# EAGLE design SparkFun_openScale (EAGLE 7.5.0)
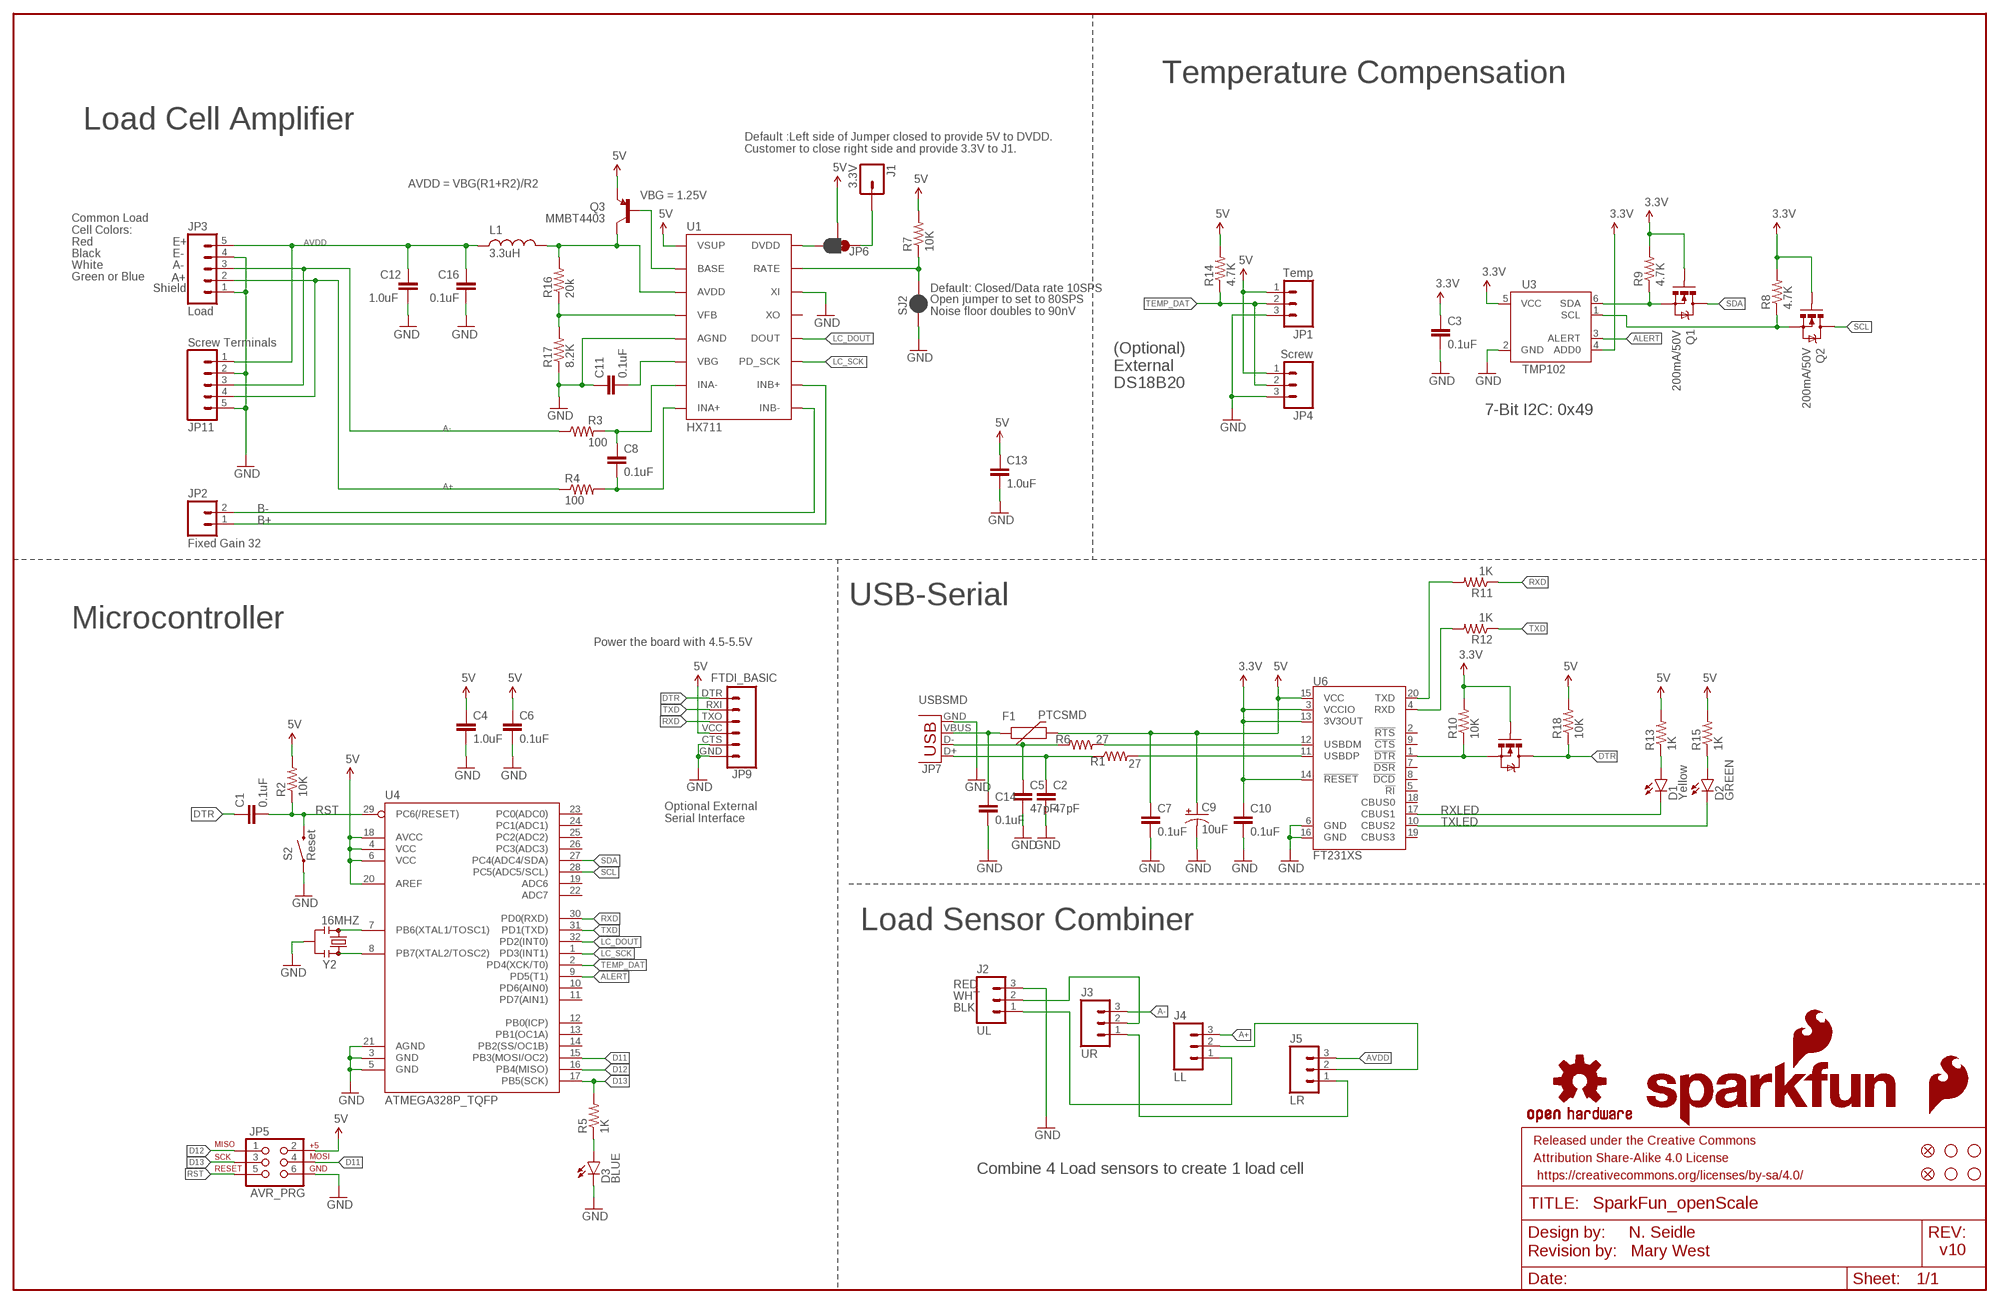
[diagram p0: schematic, sheet 1]

## Parts
C1  0.1uF  0.1UF-25V(+80/-20%)(0603)  [0603-CAP]
C2  47pF  47PF-50V-5%(0603)  [0603-CAP]
C3  0.1uF  0.1UF-25V(+80/-20%)(0603)  [0603-CAP]
C4  1.0uF  1.0UF-16V-10%(0603)  [0603-CAP]
C5  47pF  47PF-50V-5%(0603)  [0603-CAP]
C6  0.1uF  0.1UF-25V(+80/-20%)(0603)  [0603-CAP]
C7  0.1uF  0.1UF-25V(+80/-20%)(0603)  [0603-CAP]
C8  0.1uF  0.1UF-25V(+80/-20%)(0603)  [0603-CAP]
C9  10uF  10UF-16V-10%(TANT)  [EIA3216]
C10  0.1uF  0.1UF-25V(+80/-20%)(0603)  [0603-CAP]
C11  0.1uF  0.1UF-25V(+80/-20%)(0603)  [0603-CAP]
C12  1.0uF  1.0UF-16V-10%(0603)  [0603-CAP]
C13  1.0uF  1.0UF-16V-10%(0603)  [0603-CAP]
C14  0.1uF  0.1UF-25V(+80/-20%)(0603)  [0603-CAP]
C16  0.1uF  0.1UF-25V(+80/-20%)(0603)  [0603-CAP]
D1  Yellow  LED-YELLOWLILYPAD  [LED-1206]
D2  GREEN  LED-GREEN1206  [LED-1206]
D3  BLUE  LED-BLUE1206  [LED-1206]
F1  PTCSMD  [PTC-1206]
FID1  FIDUCIALUFIDUCIAL  [MICRO-FIDUCIAL]
FID2  FIDUCIALUFIDUCIAL  [MICRO-FIDUCIAL]
FRAME1  FRAME-LEDGER  [CREATIVE_COMMONS]
J1  3.3V  M01PTH  [1X01]
J2  UL  M03PTH  [1X03]
J3  UR  M03PTH  [1X03]
J4  LL  M03PTH  [1X03]
J5  LR  M03PTH  [1X03]
JP1  Temp  M031X03_NO_SILK  [1X03_NO_SILK]
JP2  Fixed Gain 32  M02PTH  [1X02]
JP3  Load  M05NO_SILK  [1X05_NO_SILK]
JP4  Screw  M03SCREW_LOCK  [SCREWTERMINAL-3.5MM-3_LOCK.007S]
JP5  AVR_PRG  AVR_SPI_PRG_6PTH  [2X3]
JP6  JUMPER-PAD-3-2OF3_NC_BY_PASTE  [PAD-JUMPER-3-2OF3_NC_BY_PASTE_YES_SILK_FULL_BOX]
JP7  USBSMD  [USB-MINIB]
JP9  FTDI_BASIC  FTDI_BASICPTH  [FTDI_BASIC]
JP11  Screw Terminals  M05SCREW  [SCREWTERMINAL-3.5MM-5]
L1  3.3uH  INDUCTOR0805-IND  [0805]
LOGO2  OSHW-LOGOS  [OSHW-LOGO-S]
LOGO3  SFE_LOGO_FLAME.1_INCH  [SFE_LOGO_FLAME_.1]
LOGO4  SFE_LOGO_NAME_FLAME.1_INCH  [SFE_LOGO_NAME_FLAME_.1]
Q1  200mA/50V  MOSFET-NCHANNELBSS138  [SOT23-3]
Q2  200mA/50V  MOSFET-NCHANNELBSS138  [SOT23-3]
Q3  MMBT4403  TRANSISTOR_PNPMMBT4403  [SOT23-3]
Q4  MOSFET-NCHANNEL2N7002PW  [SOT323]
R1  27  27OHM1/10W1%(0603)  [0603]
R2  10K  10KOHM-1/10W-1%(0603)0603  [0603-RES]
R3  100  100OHM-1/10W-1%(0603)  [0603-RES]
R4  100  100OHM-1/10W-1%(0603)  [0603-RES]
R5  1K  1KOHM-1/10W-1%(0603)  [0603-RES]
R6  27  27OHM1/10W1%(0603)  [0603]
R7  10K  10KOHM-1/10W-1%(0603)0603  [0603-RES]
R8  4.7K  4.7KOHM-1/10W-1%(0603)  [0603-RES]
R9  4.7K  4.7KOHM-1/10W-1%(0603)  [0603-RES]
R10  10K  10KOHM-1/10W-1%(0603)0603  [0603-RES]
R11  1K  1KOHM-1/10W-1%(0603)  [0603-RES]
R12  1K  1KOHM-1/10W-1%(0603)  [0603-RES]
R13  1K  1KOHM-1/10W-1%(0603)  [0603-RES]
R14  4.7K  4.7KOHM-1/10W-1%(0603)  [0603-RES]
R15  1K  1KOHM-1/10W-1%(0603)  [0603-RES]
R16  20k  20KOHM1/10W1%(0603)  [0603-RES]
R17  8.2K  8.2KOHM-1/10W-5%(0603)  [0603-RES]
R18  10K  10KOHM-1/10W-1%(0603)0603  [0603-RES]
S2  Reset  SWITCH-MOMENTARY-2SMD  [TACTILE-SWITCH-SMD]
SJ2  JUMPER-PAD-2-NC_BY_PASTE  [PAD-JUMPER-2-NC_BY_PASTE_YES_SILK]
STANDOFF1  STAND-OFF  [STAND-OFF]
STANDOFF2  STAND-OFF  [STAND-OFF]
STANDOFF3  STAND-OFF  [STAND-OFF]
STANDOFF4  STAND-OFF  [STAND-OFF]
U1  HX711  HX711HX711  [SO16]
U3  TMP102  [SOT563]
U4  ATMEGA328P_TQFP  [TQFP32-08]
U6  FT231XS  [SSOP20_L]
Y2  16MHZ  RESONATOR16MHZ  [RESONATOR-SMD]

## Nets
2: J4.2 J5.2
3.3V [power]: C3.1 C10.1 Q1.1(G) Q2.1(G) Q4.1(G) R8.2 R9.2 R10.2 U3.4(ADD0) U3.5(VCC) U6.3(VCCIO) U6.13(3V3OUT) U6.14(!RESET)
5V: C4.1 C6.1 C7.1 C9.A(+) C13.1 F1.2 JP1.1 JP4.1 JP5.2 JP6.2 JP9.VCC Q3.2(E) R2.2 R7.2 R13.2 R14.2 R15.2 R18.2 U1.1(VSUP) U4.4(VCC) U4.6(VCC) U4.18(AVCC) U4.20(AREF) U6.15(VCC)
A+: J4.3 JP3.2 JP11.4 R4.1
A-: J3.3 JP3.3 JP11.3 R3.1
ALERT: U3.3(ALERT) U4.9(PD5(T1))
AVDD: C12.2 C16.1 J5.3 JP3.5 JP11.1 L1.1
B+: JP2.1 U1.10(INB+)
B-: JP2.2 U1.9(INB-)
D11: JP5.4 U4.15(PB3(MOSI/OC2))
D12: JP5.1 U4.16(PB4(MISO))
D13: JP5.3 R5.2 U4.17(PB5(SCK))
DTR: C1.1 JP9.DTR Q4.3(D) R18.1
GND [power]: C2.2 C3.2 C4.2 C5.2 C6.2 C7.2 C9.C(-) C10.2 C11.1 C12.1 C13.2 C14.2 C16.2 D3.C J2.3 JP1.3 JP3.1 JP3.4 JP4.3 JP5.6 JP7.GND JP9.CTS JP9.GND JP11.2 JP11.5 R17.1 S2.1 SJ2.1 U1.5(AGND) U1.14(XI) U3.2(GND) U4.3(GND) U4.5(GND) U4.21(AGND) U6.6(GND) U6.16(GND) Y2.2
LC_DOUT: U1.12(DOUT) U4.32(PD2(INT0))
LC_SCK: U1.11(PD_SCK) U4.1(PD3(INT1))
LV_SCL: Q2.2(S) R8.1 U3.1(SCL)
LV_SDA: Q1.2(S) R9.1 U3.6(SDA)
N$1: U4.7(PB6(XTAL1/TOSC1)) Y2.1
N$2: D3.A R5.1
N$3: U4.8(PB7(XTAL2/TOSC2)) Y2.3
N$4: C5.1 JP7.D- R6.1
N$5: D1.A R13.1
N$6: D2.A R15.1
N$7: C2.1 JP7.D+ R1.1
N$8: R6.2 U6.12(USBDM)
N$9: R7.1 SJ2.2 U1.15(RATE)
N$10: C8.1 R3.2 U1.7(INA-)
N$11: C8.2 R4.2 U1.8(INA+)
N$12: C14.1 F1.1 JP7.VBUS
N$13: R1.2 U6.11(USBDP)
N$14: R12.2 U6.4(RXD)
N$15: JP6.3 U1.16(DVDD)
N$16: R11.2 U6.20(TXD)
N$17: Q3.1(B) U1.2(BASE)
N$18: R16.1 R17.2 U1.4(VFB)
N$19: J1.1 JP6.1
N$20: J2.2 J3.2
N$21: C11.2 U1.6(VBG)
N$22: J2.1 J4.1
N$24: J3.1 J5.1
N$27: Q4.2(S) R10.1 U6.1(!DTR)
RIPUP@: L1.2 Q3.3(C) R16.2 U1.3(AVDD)
RST: C1.2 JP5.5 R2.1 S2.3 U4.29(PC6(/RESET))
RXD: JP9.TXO R11.1 U4.30(PD0(RXD))
RXLED: D1.C U6.17(CBUS1)
SCL: Q2.3(D) U4.28(PC5(ADC5/SCL))
SDA: Q1.3(D) U4.27(PC4(ADC4/SDA))
TEMP_DAT: JP1.2 JP4.2 R14.1 U4.2(PD4(XCK/T0))
TXD: JP9.RXI R12.1 U4.31(PD1(TXD))
TXLED: D2.C U6.10(CBUS2)
Unconnected: U1.13(XO) U4.10(PD6(AIN0)) U4.11(PD7(AIN1)) U4.12(PB0(ICP)) U4.13(PB1(OC1A)) U4.14(PB2(SS/OC1B)) U4.19(ADC6) U4.22(ADC7) U4.23(PC0(ADC0)) U4.24(PC1(ADC1)) U4.25(PC2(ADC2)) U4.26(PC3(ADC3)) U6.2(!RTS) U6.5(!RI) U6.7(!DSR) U6.8(!DCD) U6.9(!CTS) U6.18(CBUS0) U6.19(CBUS3)

## Notes on the sheet
- Temperature Compensation
- Load Cell Amplifier
- Default :Left side of Jumper closed to provide 5V to DVDD.
  Customer to close right side and provide 3.3V to J1.
- AVDD = VBG(R1+R2)/R2
- VBG = 1.25V
- Common Load
  Cell Colors:
- Red | E+
- Black | E-
- White | A-
- Green or Blue | A+
- Shield | Default: Closed/Data rate 10SPS
- Open jumper to set to 80SPS
  Noise floor doubles to 90nV
- (Optional)
  External
  DS18B20
- 7-Bit I2C: 0x49
- USB-Serial
- Microcontroller
- Power the board with 4.5-5.5V
- Optional External
  Serial Interface
- Load Sensor Combiner
- RED
- WHT
- BLK
- Combine 4 Load sensors to create 1 load cell
- N. Seidle
- Revision by:   Mary West | v10

## Library data of the parts
C1 C3 C6-C8 C10 C11 C14 C16 = SparkFun-Capacitors:0.1UF-25V(+80/-20%)(0603): CAP-00810 Ceramic Standard decoupling cap; PROD_ID: CAP-00810
C2 C5 = SparkFun-Capacitors:47PF-50V-5%(0603): CAP-08913; PROD_ID: CAP-08913
C4 C12 C13 = SparkFun-Capacitors:1.0UF-16V-10%(0603): CAP-00868; PROD_ID: CAP-00868
C9 = SparkFun-Capacitors:10UF-16V-10%(TANT): CAP-00811 1206/EIA-3216 Tantalum capacitor; PROD_ID: CAP-00811
D1 = SparkFun-LED:LED-YELLOW: Yellow SMD LEDs LilyPad 1206- DIO-09909 0603- DIO-09003 "SMART" means more efficient and expensive; PROD_ID: DIO-09909
D2 = SparkFun-LED:LED-GREEN: Various green LEDs Green LEDs used in SFE Production 0603- DIO-00821 LARGE- DIO-00862 LILYPAD- DIO-09910; PROD_ID: DIO-00862
D3 = SparkFun-LED:LED-BLUE: Blue LEDs for production use Various blue LEDs stocked by SparkFun production 0603 - DIO-08575 Rebel - DIO-09553 1206 - DIO-09911; PROD_ID: DIO-09911
F1 = SparkFun-PowerIC:PTC: Resettable Fuse PTC Resettable Fuse. Spark Fun Electronics SKU : COM-08357; PROD_ID: RES-11150
FID1 FID2 = SparkFun-Aesthetics:FIDUCIAL: Fiducial Alignment Points Various fiducial points for machine vision alignment.
FRAME1 = SparkFun-Aesthetics:FRAME-LEDGER: Schematic Frame Standard 11x14 US Ledger frame; DESIGNER: N. Seidle; VERSION: v02
J1 = SparkFun-Connectors:M01: Header 1 Standard 1-pin 0.1" header. Use with straight break away headers (SKU : PRT-00116), right angle break away headers (PRT-00553), swiss pins (PRT-00743), machine pins (PRT-00117), and female headers (PRT-00115). SMTSO-256-ET is a "flush mount" nut for a 4-40 screw. The older package used to be too tight, and did not allow it to sit properly thru the drill hit. The latest (0.165DIA) fits nice and snug.
J2-J5 JP1 = SparkFun-Connectors:M03: Header 3 Standard 3-pin 0.1" header. Use with straight break away headers (SKU : PRT-00116), right angle break away headers (PRT-00553), swiss pins (PRT-00743), machine pins (PRT-00117), and female headers (PRT-00115). Molex polarized connector foot print use with SKU : PRT-08232 with associated crimp pins and housings.
JP2 = SparkFun-Connectors:M02: Standard 2-pin 0.1" header. Use with - straight break away headers ( PRT-00116) - right angle break away headers (PRT-00553) - swiss pins (PRT-00743) - machine pins (PRT-00117) - female headers (PRT-00115) Molex polarized connector foot print use with: PRT-08233 with associated crimp pins and housings. 2.54_SCREWTERM for use with PRT-10571. 3.5mm Screw Terminal footprints for PRT-08084 5mm Screw Terminal footprints for use with PRT-08432
JP3 = SparkFun-Connectors:M05: Header 5 Standard 5-pin 0.1" header. Use with straight break away headers (SKU : PRT-00116), right angle break away headers (PRT-00553), swiss pins (PRT-00743), machine pins (PRT-00117), and female headers (PRT-00115). Molex polarized connector foot print use with SKU : PRT-08230 with associated crimp pins and housings.
JP4 = SparkFun-Connectors:M03: Header 3 Standard 3-pin 0.1" header. Use with straight break away headers (SKU : PRT-00116), right angle break away headers (PRT-00553), swiss pins (PRT-00743), machine pins (PRT-00117), and female headers (PRT-00115). Molex polarized connector foot print use with SKU : PRT-08232 with associated crimp pins and housings.; PROD_ID: CONN-08288
JP5 = SparkFun-Connectors:AVR_SPI_PRG_6: AVR ISP 6 Pin This is the reduced ISP connector for AVR programming. Common on Arduino. This footprint will take up less PCB space and can be used with a 10-pin to 6-pin adapter such as SKU: BOB-08508 **Special note about "TEST_POINT" package. The stop mask is on the top side, so if you want your programming test points to be on the bottom of your board, make sure to place this package on the bottom side of the board. This also ensure that the orientation to program from the bottom side will be correct.
JP6 = SparkFun-Passives:JUMPER-PAD-3-2OF3_NC_BY_PASTE
JP7 = SparkFun-Connectors:USB: USB Connectors USB-B-PTH is fully proven SKU : PRT-00139/CONN-08278 USB-miniB is fully proven SKU : PRT-00587 USB-A-PCB is untested. USB-A-H is throughly reviewed, but untested. Spark Fun Electronics SKU : PRT-00437 USB-B-SMT is throughly reviewed, but untested. Needs silkscreen touching up. USB-A-S has not been used/tested USB-MB-H has not been used/tested USB-MICROB has been used. CONN-09505; PROD_ID: CONN-08193
JP9 = SparkFun-Connectors:FTDI_BASIC: FTDI Basic header with labels
JP11 = SparkFun-Connectors:M05: Header 5 Standard 5-pin 0.1" header. Use with straight break away headers (SKU : PRT-00116), right angle break away headers (PRT-00553), swiss pins (PRT-00743), machine pins (PRT-00117), and female headers (PRT-00115). Molex polarized connector foot print use with SKU : PRT-08230 with associated crimp pins and housings.; PROD_ID: Combine 8288+8399
L1 = SparkFun-Passives:INDUCTOR: Inductors Basic Inductor/Choke - 0603 and 1206. Footprints are not proven and vary greatly between part numbers. INDUCTOR POWER 3.3UH 4.0A SMD 0.197" L x 0.197" W x 0.177" H (5.00mm x 5.00mm x 4.50mm); PROD_ID: NDUC-13076
LOGO2 = SparkFun-Aesthetics:OSHW-LOGO: Open Source Hardware Logo This logo indicates the piece of hardware it is found on incorporates a OSHW license and/or adheres to the definition of open source hardware found here: http://freedomdefined.org/OSHW
LOGO3 = SparkFun-Aesthetics:SFE_LOGO_FLAME: SFE Logo, flame only This is the SparkFun flame logo. The logo on the schematic will always be the same size; the package variant is the height of the flame. Default layer for the logo on the board is tSilk.
LOGO4 = SparkFun-Aesthetics:SFE_LOGO_NAME_FLAME: SFE Logo, name and flame This is the SparkFun full logo. The logo on the schematic will always be the same size; the package variant is the height of the flame part of the logo. Default layer for the logo on the board is tSilk.
Q1 Q2 = SparkFun-DiscreteSemi:MOSFET-NCHANNEL: Common NMOSFET Parts MFG P/N Store ID Prod ID FDD8780 TRANS-09984 SI7820DN TRANS-11055 FDS6630A IC-08089 2N7002PW TRANS-11151 FQP30N06L COM-10213 TRANS-10060 BSS123LT1G TRANS-08345 BSS138 TRANS-00830 BS170 2N7000; PROD_ID: TRANS-00830
Q3 = SparkFun-DiscreteSemi:TRANSISTOR_PNP: Generic PNP BJT Double check pinouts against datasheets- not all devices are the same! MMBT3906 - 40V 200mA SOT-23 (TRANS-08052) MMBT4403 - 40V 600mA SOT-23 (TRANS-09245); PROD_ID: TRANS-09245
Q4 = SparkFun-DiscreteSemi:MOSFET-NCHANNEL: Common NMOSFET Parts MFG P/N Store ID Prod ID FDD8780 TRANS-09984 SI7820DN TRANS-11055 FDS6630A IC-08089 2N7002PW TRANS-11151 FQP30N06L COM-10213 TRANS-10060 BSS123LT1G TRANS-08345 BSS138 TRANS-00830 BS170 2N7000; PROD_ID: TRANS-11151
R1 R6 = SparkFun-Resistors:27OHM1/10W1%(0603): RES-09334; PROD_ID: RES-09334
R2 R7 R10 R18 = SparkFun-Resistors:10KOHM-1/10W-1%(0603): RES-00824; PROD_ID: RES-00824
R3 R4 = SparkFun-Resistors:100OHM-1/10W-1%(0603): RES-07863; PROD_ID: RES-07863
R5 R11-R13 R15 = SparkFun-Resistors:1KOHM-1/10W-1%(0603): RES-07856; PROD_ID: RES-07856
R8 R9 R14 = SparkFun-Resistors:4.7KOHM-1/10W-1%(0603): RES-07857; PROD_ID: RES-07857
R16 = SparkFun-Resistors:20KOHM1/10W1%(0603): RES-09383; PROD_ID: RES-09383
R17 = SparkFun-Resistors:8.2KOHM-1/10W-5%(0603): RES-10646; PROD_ID: RES-10646
S2 = SparkFun-Electromechanical:SWITCH-MOMENTARY-2: Various NO switches- pushbuttons, reed, etc; PROD_ID: SWCH-08247
SJ2 = SparkFun-Passives:JUMPER-PAD-2-NC_BY_PASTE
STANDOFF1-STANDOFF4 = SparkFun-Electromechanical:STAND-OFF: #4 Stand Off This is the mechanical footprint for a #4 phillips button head screw. Use the keepout ring to avoid running the screw head into surrounding components. SKU : PRT-00447
U1 = Testing:HX711; PROD_ID: IC-12445
U3 = SparkFun-Sensors:TMP102: I2C degC temp sensor; PROD_ID: IC-09303
U4 = SparkFun-DigitalIC:ATMEGA328P_TQFP; PROD_ID: IC-09069
U6 = SparkFun-DigitalIC:FT231X: FTDI FT231X Full Speed USB to Full-handshake UART This USB2.0 Full Speed IC offers a compact bridge to full handshake UART interfaces. The device is a UART, capable of operating up to 3MBaud, with low power consumption (8mA). The FT231X includes the complete FT-X series feature set and enables USB to be added into a system design quickly and easily over a UART interface.; PROD_ID: IC-11524
Y2 = SparkFun-FreqCtrl:RESONATOR: Resonator Small SMD resonator. Used, eg, on the Arduino Pro/ Pro Mini boards. 8MHz- XTAL-08895 16MHz- XTAL-08900; PROD_ID: XTAL-08900

## Net classes
1 power: width 0.203 mm

## Board
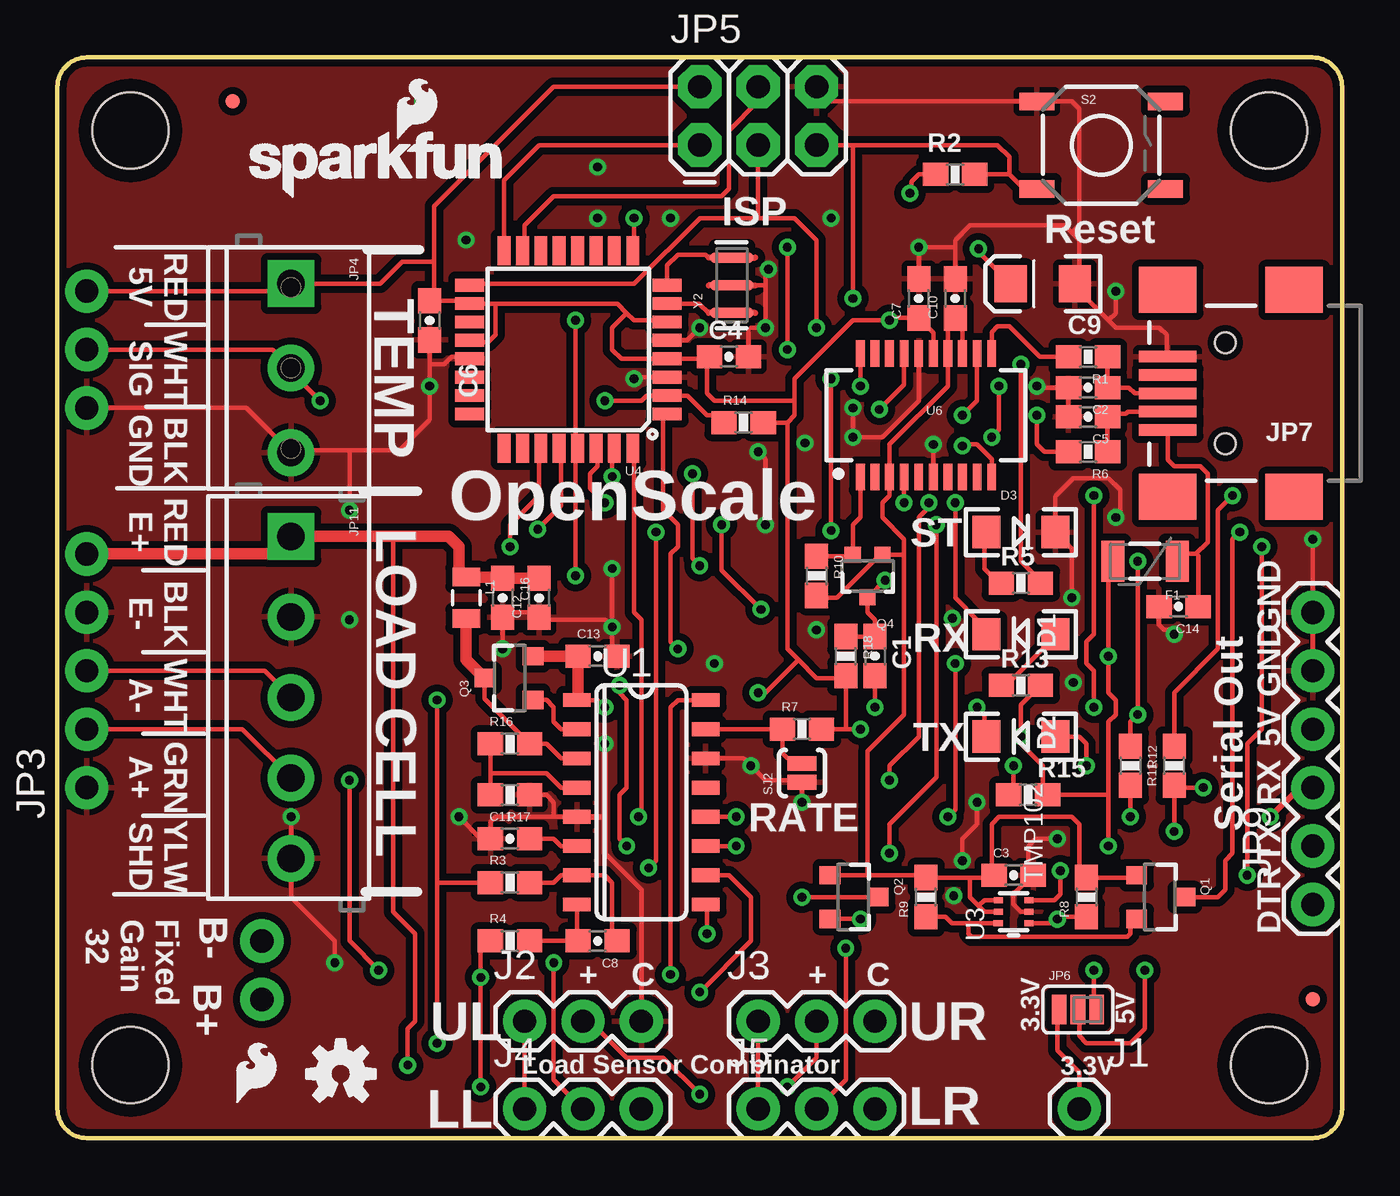
[diagram p1: board, top side]
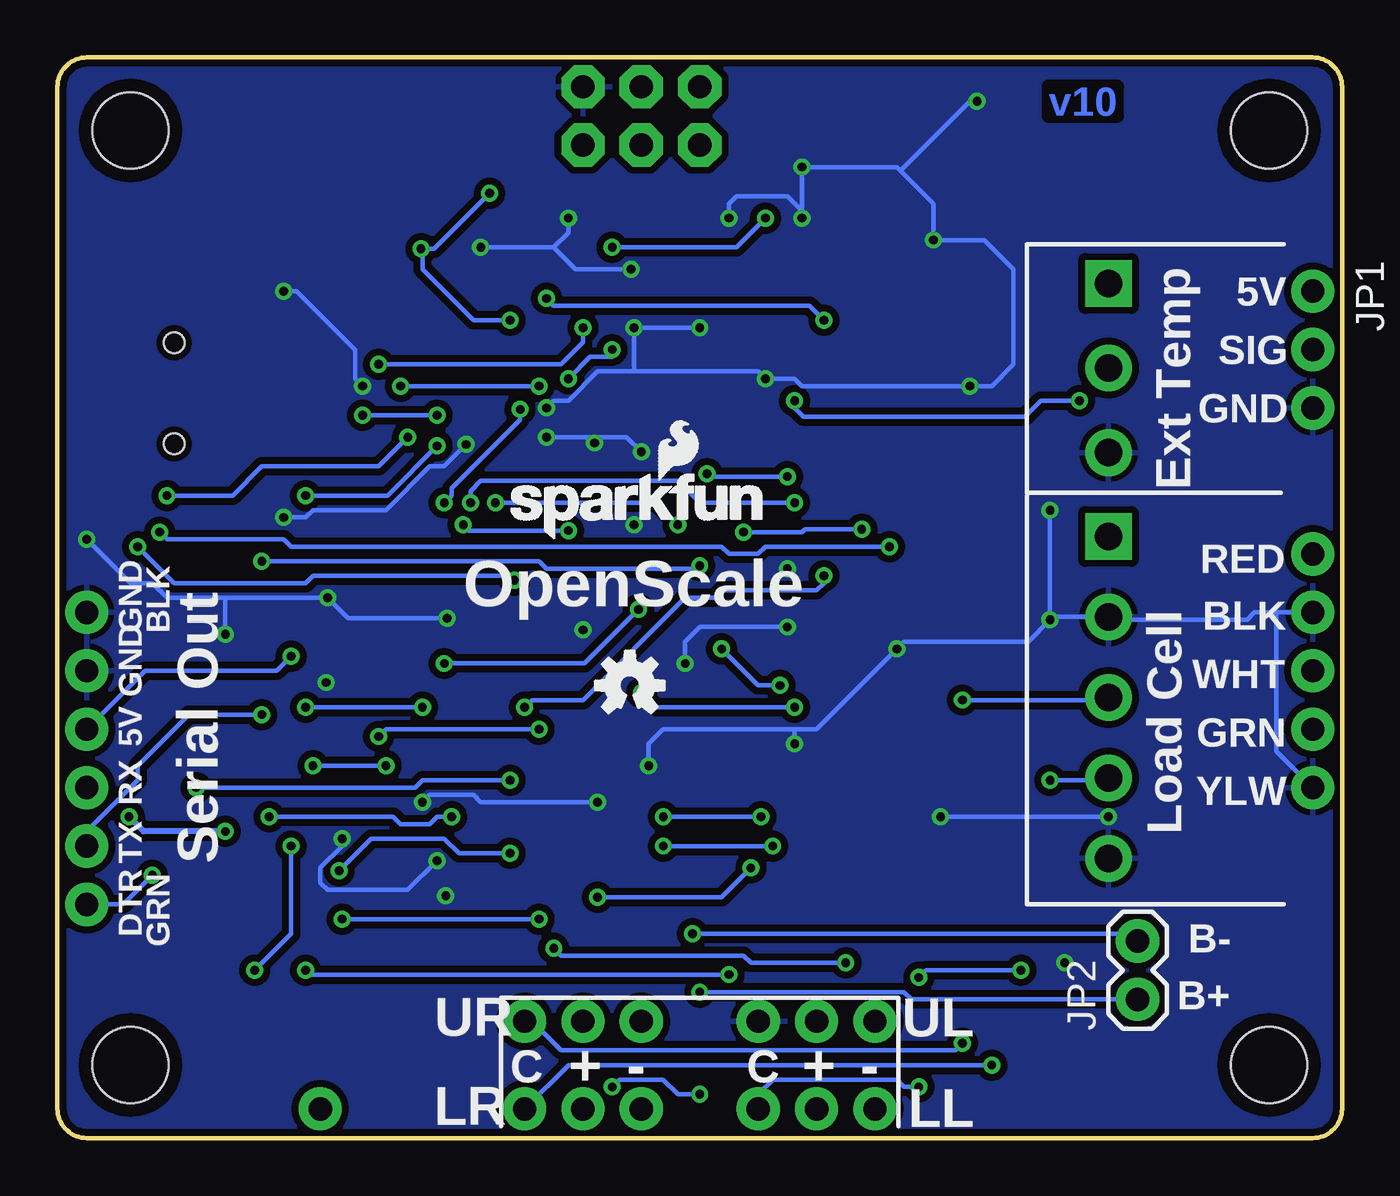
[diagram p2: board, bottom side, seen from below]

Size 55.88 x 46.99 mm. Coordinates in mm from the lower left corner, seen from the top.
Outline: 53.34,46.99 1.27,46.99 arc90 0,45.72 0,1.27 arc90 1.27,0 54.61,0 arc90 55.88,1.27 55.88,45.72 arc90 54.61,46.99 53.09,46.99
Copper layers (1*16): Top 0.035mm / dielectric 1.5mm / Bottom 0.035mm
Design rules "SparkFun-2-layer-TIGHT": minimum track width 7mil, minimum drill 15mil, track to track 7mil, track to pad 7mil, pad to pad 7mil, via to via 7mil, smd to smd 7mil, copper to edge 7mil, drill to drill 7mil, minimum pad ring 7mil, minimum via ring 7mil, stop-mask expansion 4mil, vias tented up to drill 25mil, thermal gap 10mil

### Footprints (pad centres in the part's own frame; a part is rotated, then mirrored left to right if it is on the bottom)
0603-CAP = smd 1.1 x 1: 1 -0.85,0; 2 0.85,0
EIA3216 = smd 1.4 x 1.6: A 1.4,0; C -1.4,0
LED-1206 = smd 1.2 x 1.4: A -1.5,0; C 1.5,0
PTC-1206 = smd 1 x 1.8: 1 -1.4,0; 2 1.4,0
MICRO-FIDUCIAL = smd 0.635 x 0.635: 1 0,0
1X01 = drill 1.016 pad 1.88: 1 0,0
1X03 = drill 1.016 pad 1.88: 1 0,0; 2 2.54,0; 3 5.08,0
1X03_NO_SILK = drill 1.016 pad 1.88: 1 0,0; 2 2.54,0; 3 5.08,0
1X02 = drill 1.016 pad 1.88: 1 0,0; 2 2.54,0
1X05_NO_SILK = drill 1.016 pad 1.88: 1 0,0; 2 2.54,0; 3 5.08,0; 4 7.62,0; 5 10.16,0
SCREWTERMINAL-3.5MM-3_LOCK.007S = drill 1.2 pad 2.032 square: 1 -0.178,0 | drill 1.2 pad 2.032: 2 3.5,0; 3 7.178,0
2X3 = drill 1.016 pad 1.88 octagon: 1 0,0; 2 0,2.54; 3 2.54,0; 4 2.54,2.54; 5 5.08,0; 6 5.08,2.54
PAD-JUMPER-3-2OF3_NC_BY_PASTE_YES_SILK_FULL_BOX = smd 0.635 x 1.27: 1 -0.813,0; 2 0,0; 3 0.813,0
USB-MINIB = smd 2.5 x 0.5: D+ 2.5,0; D- 2.5,0.8; GND 2.5,-1.6; ID 2.5,-0.8; VBUS 2.5,1.6 | smd 2.5 x 2: MTN1 -3,4.5; MTN2 2.5,4.5; MTN3 -3,-4.5; MTN4 2.5,-4.5 | hole 0.9: 0,2.2; 0,-2.2
FTDI_BASIC = drill 1.016 pad 1.88: CTS 10.16,0; DTR 0,0; GND 12.7,0; RXI 2.54,0; TXO 5.08,0; VCC 7.62,0
SCREWTERMINAL-3.5MM-5 = drill 1.2 pad 2.032 square: 1 0,0 | drill 1.2 pad 2.032: 2 3.5,0; 3 7,0; 4 10.5,0; 5 14,0
0805 = smd 0.8 x 1.2: 1 -0.9,0; 2 0.9,0
SOT23-3 = smd 0.8 x 0.9: 1 -0.95,-1; 2 0.95,-1; 3 0,1.1
SOT323 = smd 0.7 x 0.7: 1 -0.65,-0.925; 2 0.65,-0.925; 3 0,0.925
0603 = smd 1.1 x 1: 1 -0.85,0; 2 0.85,0
0603-RES = smd 1.1 x 1: 1 -0.85,0; 2 0.85,0
TACTILE-SWITCH-SMD = smd 1.524 x 0.762: 1 -2.794,1.905; 2 2.794,1.905; 3 -2.794,-1.905; 4 2.794,-1.905
PAD-JUMPER-2-NC_BY_PASTE_YES_SILK = smd 0.635 x 1.27: 1 -0.401,0; 2 0.413,0
STAND-OFF = hole 3.302: 0,0
SO16 = smd 0.6 x 1.2: 1 -4.445,-2.8; 2 -3.175,-2.8; 3 -1.905,-2.8; 4 -0.635,-2.8; 5 0.635,-2.8; 6 1.905,-2.8; 7 3.175,-2.8; 8 4.445,-2.8; 9 4.445,2.8; 10 3.175,2.8; 11 1.905,2.8; 12 0.635,2.8; 13 -0.635,2.8; 14 -1.905,2.8; 15 -3.175,2.8; 16 -4.445,2.8
SOT563 = smd 0.25 x 0.4: 1 -0.5,-0.66; 2 0,-0.66; 3 0.5,-0.66; 4 0.5,0.66; 5 0,0.66; 6 -0.5,0.67
TQFP32-08 = smd 1.27 x 0.559: 1 -4.293,2.8; 2 -4.293,2; 3 -4.293,1.2; 4 -4.293,0.4; 5 -4.293,-0.4; 6 -4.293,-1.2; 7 -4.293,-2; 8 -4.293,-2.8; 17 4.293,-2.8; 18 4.293,-2; 19 4.293,-1.2; 20 4.293,-0.4; 21 4.293,0.4; 22 4.293,1.2; 23 4.293,2; 24 4.293,2.8 | smd 0.559 x 1.27: 9 -2.8,-4.293; 10 -2,-4.293; 11 -1.2,-4.293; 12 -0.4,-4.293; 13 0.4,-4.293; 14 1.2,-4.293; 15 2,-4.293; 16 2.8,-4.293; 25 2.8,4.293; 26 2,4.293; 27 1.2,4.293; 28 0.4,4.293; 29 -0.4,4.293; 30 -1.2,4.293; 31 -2,4.293; 32 -2.8,4.293
SSOP20_L = smd 0.381 x 1.143: 1 -2.857,-2.68; 2 -2.223,-2.68; 3 -1.587,-2.68; 4 -0.953,-2.68; 5 -0.318,-2.68; 6 0.318,-2.68; 7 0.953,-2.68; 8 1.587,-2.68; 9 2.223,-2.68; 10 2.857,-2.68; 11 2.857,2.68; 12 2.223,2.68; 13 1.587,2.68; 14 0.953,2.68; 15 0.318,2.68; 16 -0.318,2.68; 17 -0.953,2.68; 18 -1.587,2.68; 19 -2.223,2.68; 20 -2.857,2.68
RESONATOR-SMD = smd 0.45 x 1.905: 1 -1.2,0; 2 0,0; 3 1.2,0

### Placement (x,y rotation side)
C1  35.56,20.95 270 top
C2  44.83,32.64 180 top
C3  41.59,11.43 0 top
C4  29.21,33.97 0 top
C5  44.83,31.37 180 top
C6  16.19,35.56 270 top
C7  37.47,36.51 90 top
C8  23.5,8.57 180 top
C9  42.86,37.15 180 top
C10  39.05,36.51 90 top
C11  19.68,13.02 0 top
C12  20.95,23.5 90 top
C13  23.5,20.95 0 top
C14  48.77,23.11 180 top
C16  19.37,23.5 270 top
D1  41.91,21.91 180 top
D2  41.91,17.46 180 top
D3  41.91,26.35 0 top
F1  47.31,25.08 180 top
FID1  54.61,6.03 0 top
FID2  7.62,45.09 0 top
FRAME1  4.45,-8.26 0 top  (outside the outline)
J1  44.45,1.27 0 top
J2  20.32,5.08 0 top
J3  30.48,5.08 0 top
J4  20.32,1.27 0 top
J5  30.48,1.27 0 top
JP1  1.27,36.83 270 bottom
JP2  8.89,6.03 90 bottom
JP3  1.27,15.24 90 top
JP4  10.16,36.98 270 top
JP5  27.94,43.18 0 top
JP6  44.39,5.59 0 top
JP7  50.8,32.38 180 top
JP9  54.61,10.16 90 top
JP11  10.16,26.16 270 top
L1  17.78,23.5 270 top
LOGO1  SFE_LOGO_NAME_FLAME.1_INCH  [SFE_LOGO_NAME_FLAME_.1]  7.94,40.83 0 top
LOGO2  30.99,19.68 0 bottom
LOGO3  7.49,1.21 0 top
LOGO4  36.58,25.97 0 bottom
LOGO5  OSHW-LOGOS  [OSHW-LOGO-S]  12.32,2.79 0 top
Q1  47.94,10.48 270 top
Q2  34.61,10.48 270 top
Q3  19.68,20 90 top
Q4  35.24,24.45 180 top
R1  44.83,33.97 180 top
R2  39.05,41.91 180 top
R3  19.68,11.11 0 top
R4  19.68,8.57 0 top
R5  41.91,24.13 0 top
R6  44.83,29.84 180 top
R7  32.38,17.78 0 top
R8  44.77,10.48 90 top
R9  37.78,10.48 90 top
R10  33.02,24.45 270 top
R11  48.58,16.19 90 top
R12  46.67,16.19 270 top
R13  41.91,19.68 0 top
R14  29.84,31.11 0 top
R15  42.23,14.92 0 top
R16  19.68,17.14 0 top
R17  19.68,14.92 180 top
R18  34.29,20.95 270 top
S2  45.4,43.18 0 top
SJ2  32.38,15.88 90 top
STANDOFF1  52.7,43.81 0 top
STANDOFF2  52.7,3.17 0 top
STANDOFF3  3.17,3.17 0 top
STANDOFF4  3.17,43.81 0 top
U1  25.4,14.61 270 top
U3  41.59,9.84 90 top
U4  22.23,34.29 180 top
U6  37.78,31.43 0 top
Y2  29.34,37.08 90 top

### Tracks (layer width: path | path; a pad name or v marks a point on that pad's centre or on a via)
2  (via drill 0.38)
  Top 0.203: v21.59,7.62 21.59,2.54 J4.2 | v34.29,8.26 34.29,2.54 J5.2
  Bottom 0.203: v21.59,7.62 25.72,7.62 26.04,7.94 33.97,7.94 v34.29,8.26
3.3V
  Top 0.203: U6.13 39.37,35.34 C10.1 38.73,35.34 U6.14 38.73,32.7 36.2,30.16 U6.3 36.2,27.94 35.88,27.62 35.88,26.99 36.83,26.04 36.83,25.4 | 39.69,11.33 40.64,11.33 C3.1 40.64,11.53 40.64,13.65 40.96,13.97 44.13,13.97 44.45,13.65 44.45,11.64 R8.2 46.84,11.33 Q1.1 | U3.5 40.32,9.84 40.07,10.1 | 40.07,10.1 39.69,10.48 39.69,11.33 | 39.69,11.33 R9.2 37.68,11.43 35.24,11.43 | Q2.1 35.24,11.43 | 36.83,25.4 36.83,18.41 35.24,16.83 35.24,11.43 | 36.83,25.4 36.8,25.37 Q4.1 35.79,25.37 33.91,23.5 33.12,23.5 R10.2 | U3.4 40.31,10.34 40.07,10.1
5V  (via drill 0.38)
  Top 0.203: U6.15 38.1,35.03 C7.1 36.3,35.66 v36.2,35.56 34.61,35.56 32.07,33.02 32.07,32.07 | 19.05,36.29 U4.18 17.81,36.41 C6.1 16.38,36.6 16.38,38.1 | 19.05,36.29 24.35,36.29 24.77,35.88 | 32.07,32.07 28.57,32.07 28.26,32.38 28.26,33.87 C4.1 28.28,33.89 U4.4 24.53,33.89 24.13,34.29 24.13,35.24 24.77,35.88 | R14.2 31.75,31.11 | 31.75,31.11 32.07,31.43 32.07,32.07 | C13.1 | 22.64,19.09 U1.1 23.5,19.05 v23.81,18.73 | 33.02,17.78 R7.2 33.66,17.78 | 45.72,14.92 R15.2 42.86,14.92 42.86,16.19 41.91,17.14 v41.91,17.46 41.91,18.84 R13.2 42.55,19.68 | 33.66,18.1 33.66,17.78 | F1.2 45.72,25.08 v45.72,20.95 45.72,19.37 46.04,19.05 46.04,18.41 45.72,18.1 45.72,14.92 | JP6.2 44.45,5.65 44.45,4.45 44.77,4.13 46.67,4.13 47.31,4.76 v47.31,7.3 | v34.92,17.78 34.29,17.78 | 34.29,17.78 33.66,17.78 | 31.75,31.11 31.75,21.27 32.23,20.8 | 32.23,20.8 33.02,20 33.87,20 33.97,20.11 R18.2 34.29,17.78 | 45.72,14.92 v45.72,12.7 | 24.77,35.88 25.08,35.56 26.45,35.56 U4.6 | 19.05,36.29 19.05,34.92 18.73,34.61 18.02,34.61 U4.20 | v40.07,38.67 40.07,38.54 C9.A | JP5.2 21.59,45.72 16.38,40.51 16.38,38.1 | R2.2 37.47,41.91 37.15,41.59 37.15,41.15 v37.08,41.08 | JP1.1 9.83,36.83 JP4.1 14.05,37.16 14.99,38.1 16.38,38.1 | v30.48,19.37 30.8,19.37 32.23,20.8
  Top 0.508: Q3.2 C13.1 | C13.1 22.64,19.09
  Bottom 0.203: v36.2,35.56 37.78,35.56 40.01,37.78 40.01,38.61 v40.07,38.67 39.5,38.67 v37.08,41.08 | v45.72,12.7 45.72,8.89 v47.31,7.3 | v34.92,17.78 41.59,17.78 v41.91,17.46 | v45.72,20.95 46.35,20.32 52.07,20.32 JP9.VCC | v23.81,18.73 29.84,18.73 v30.48,19.37
A+  (via drill 0.38)
  Top 0.203: JP3.2 8.04,17.78 JP11.4 | v18.41,2.22 v18.41,6.99 18.41,8.57 R4.1 | v12.7,15.56 12.7,8.57 v13.97,7.3
  Bottom 0.203: v12.7,15.56 10.16,15.56 JP11.4 | v13.97,7.3 18.1,7.3 v18.41,6.99 | v18.41,2.22 19.05,2.22 19.37,2.54 24.77,2.54 25.4,1.91 J4.3
A-  (via drill 0.38)
  Top 0.203: JP3.3 9,20.32 JP11.3 | v16.51,19.05 16.51,11.18 | 16.51,11.18 v16.51,4.13 | R3.1 16.57,11.11 16.51,11.18
  Bottom 0.203: v16.51,19.05 10.16,19.05 JP11.3 | J3.3 35.24,5.08 33.97,3.81 16.83,3.81 v16.51,4.13
ALERT  (via drill 0.38)
  Top 0.203: U4.9 25.02,38.48 25.08,38.42 v25.08,40.01 | v31.75,38.73 v31.75,34.29 | U3.3 43.36,10.34 43.62,10.6 v43.62,11.62 | v38.23,26.67 38.23,15.68 36.2,13.65 v36.2,12.38 | v33.66,33.02 v33.66,26.42
  Bottom 0.203: v43.62,11.62 42.23,13.02 39.05,13.02 38.42,12.38 v36.2,12.38 | v31.75,34.29 31.75,33.97 32.7,33.97 v33.66,33.02 | v31.75,38.73 26.35,38.73 v25.08,40.01 | v33.66,26.42 37.97,26.42 v38.23,26.67
AVDD  (via drill 0.38)
  Top 0.203: 15.56,26.16 14.73,26.16 14.61,26.04 14.61,9.84 15.56,8.89 15.56,5.08 15.24,4.76 v15.24,3.17
  Top 0.508: JP3.5 9.4,25.4 JP11.1 15.56,26.16 17.02,26.16 17.46,25.72 17.46,24.71 L1.1 19.32,24.39 C16.1 C12.2
  Bottom 0.203: v15.24,3.17 33.66,3.17 J5.3
B+  (via drill 0.38)
  Top 0.203: U1.10 29.21,11.43 30.16,10.48 30.16,8.57 v27.94,6.35
  Bottom 0.203: v27.94,6.35 19.05,6.35 18.73,6.03 JP2.1
B-  (via drill 0.38)
  Top 0.203: 27.94,10.16 U1.9 28.26,10.1 v28.26,8.89
  Bottom 0.203: v28.26,8.89 9.21,8.89 JP2.2
D11
  Top 0.203: JP5.4 30.48,45.09 29.21,43.81 29.21,41.27 28.89,40.96 21.59,40.96 20.32,39.69 20.32,38.68 U4.15
D12
  Top 0.203: U4.16 19.43,41.65 20.95,43.18 JP5.1
D13  (via drill 0.38)
  Top 0.203: 30.48,40.01 32.07,40.01 33.02,39.05 v33.02,35.24 | 30.48,40.01 27.94,40.01 25.08,37.15 17.99,37.15 U4.17 | R5.2 42.55,24.13 42.55,24.45 41.91,25.08 v41.91,33.66 | JP5.3 30.48,40.01
  Bottom 0.203: v33.02,35.24 33.02,34.61 33.97,33.66 v41.91,33.66
DTR  (via drill 0.38)
  Top 0.203: v52.39,25.72 52.39,17.78 51.75,17.14 v51.75,11.43 | v36.01,24.26 35.27,23.52 Q4.3 35.24,22.86 35.56,22.54 C1.1 R18.1
  Bottom 0.203: v52.39,25.72 50.8,24.13 45.09,24.13 44.77,24.45 36.2,24.45 v36.01,24.26 | JP9.DTR 53.02,10.16 v51.75,11.43
GND  (via drill 0.38)
  Top 0.203: 16.19,33.66 v16.19,32.7 16.19,31.23 14.88,29.92 12.75,29.92 | 16.19,33.66 C6.2 | R17.1 21.27,14.92 21.59,14.61 21.59,13.97 | v10.16,13.97 JP11.5 10.16,10.48 12.06,8.57 v12.06,7.62 | Y2.2 30.1,37.08 30.16,37.15 | v32.38,14.61 SJ2.1 32.38,15.56 30.8,15.56 v30.16,16.19 29.84,16.51 U1.14 | 42.86,11.43 C3.2 | 24.13,20.95 C13.2 | J2.3 25.4,10.79 23.81,12.38 | C5.2 C2.2 42.67,32.64 v42.61,32.7 | JP9.CTS JP9.GND v54.61,26.04 | v43.5,13.02 42.55,13.02 42.23,12.7 42.23,11.64 C3.2 | v39.37,12.06 39.37,13.02 40.01,13.65 v40.01,14.61 | v17.46,13.97 18.41,13.02 C11.1 18.84,13.76 19.05,13.97 21.59,13.97 | 21.59,13.97 U1.5 | v19.37,21.27 C16.2 19.37,22.86 20.95,22.86 C12.1 21.06,22.54 23.81,22.54 v24.13,22.23 | 24.13,20.64 24.13,20.95 | 24.13,20.95 v24.13,22.23 | C7.2 v37.47,38.73 39.05,38.73 | C10.2 39.05,38.73 | 39.05,38.73 39.05,39.05 39.69,39.69 43.81,39.69 44.13,39.37 | 44.13,39.37 44.45,39.05 44.45,37.34 C9.C 44.26,37.02 45.72,35.56 | 45.72,35.56 46.04,35.24 47.94,35.24 48.26,34.92 48.26,34.02 JP7.GND | v46.04,36.83 46.04,35.88 45.72,35.56 | U6.16 37.47,32.07 35.88,30.48 v34.61,30.48 v34.61,31.75 | v38.1,30.16 U6.6 | 44.13,39.37 44.45,39.69 44.45,44.77 44.13,45.09 S2.1 33.66,45.09 JP5.6 | 18.1,33.97 17.78,33.97 | 17.78,33.97 17.14,33.97 16.83,33.66 16.19,33.66 | U4.21 17.86,33.89 17.78,33.97 | U4.3 25.15,33.09 v25.08,33.02 | U4.5 27.39,34.69 v27.94,35.24 | C3.2 42.42,11.43 41.59,10.6 41.59,10.16 41.91,9.84 U3.2 | v30.48,29.84 30.8,29.53 v30.8,26.67 | 30.8,37.15 v30.8,35.24 30.16,35.24 30.06,35.14 C4.2 | 30.8,37.15 30.8,37.66 v30.92,37.78 | 30.35,37.08 30.73,37.08 30.8,37.15 | v24.13,24.77 v24.13,22.23
  Top 0.203: 12.75,29.92 10.28,29.92 JP4.3 8.21,31.75 JP1.3 | v12.7,27.3 12.7,29.87 12.75,29.92 | C14.2 47.92,22.31 48.13,22.1 48.39,22.1 v48.58,21.91 | v44.13,23.5 44.13,25.63 D3.C 43.41,27.92 44.2,28.7 45.72,28.7 46.23,28.19 46.23,27.18 v46.04,26.99
  Top 0.254: U1.5 23.81,13.97 | 23.81,12.38 23.81,13.97 | 23.81,13.97 v23.81,17.14
  Bottom 0.203: v12.7,22.54 v12.7,27.3 | JP3.4 2.86,22.86 | 2.86,22.86 3.81,22.86 4.13,22.54 10.04,22.54 JP11.2 12.58,22.66 v12.7,22.54 | v12.7,22.54 13.65,21.59 19.05,21.59 v19.37,21.27 22.86,17.78 23.81,17.78 | v17.46,13.97 v10.16,13.97 | 23.81,17.78 29.53,17.78 30.16,17.14 v30.16,16.19 | 23.81,17.78 v23.81,17.14 | v39.37,12.06 40.64,10.79 44.13,10.79 44.45,11.11 44.45,11.75 43.5,12.7 v43.5,13.02 | v32.38,14.61 37.47,14.61 37.78,14.92 39.69,14.92 v40.01,14.61 | v54.61,26.04 52.7,24.13 51.75,24.13 51.12,23.5 48.58,23.5 | 48.58,23.5 v44.13,23.5 43.24,22.61 v38.92,22.61 | v27.94,35.24 v30.8,35.24 30.8,33.34 | v38.1,30.16 39.05,29.21 39.69,29.21 41.59,27.3 44.77,27.3 45.09,26.99 v46.04,26.99 | v34.61,31.75 34.29,32.07 33.66,32.07 32.38,33.34 30.8,33.34 | 2.86,22.86 2.86,16.83 JP3.1 | v37.47,38.73 34.29,38.73 | v30.48,29.84 31.11,30.48 v34.61,30.48 | 34.29,38.73 33.34,37.78 v30.92,37.78 | v33.66,40.01 33.66,39.37 34.29,38.73 | v48.58,21.91 48.58,23.5 | 30.8,33.34 25.4,33.34 v25.08,33.02 23.81,33.02 23.5,32.7 v16.19,32.7 15.24,32.7 14.29,33.66 14.29,37.78 15.56,39.05 v17.78,39.05 17.78,40.64 19.21,42.07 | 19.21,42.07 19.37,42.23 v23.5,42.23 v23.5,40.01 23.5,40.32 24.13,40.96 26.35,40.96 26.67,40.64 v26.67,40.01 | v15.88,45.09 16.19,45.09 19.21,42.07 | v28.57,20.64 28.57,21.59 27.94,22.23 v24.13,22.23 | v46.04,36.83 45.47,36.83 42.93,34.29 42.93,33.02 v42.61,32.7
  other vias: 32.51,30.23 33.02,22.1 44.2,19.81 38.99,10.54
  pour Bottom (isolate 0.305, rank 6): 55.75,46.99 -0.13,46.99 -0.32,0 55.88,0
  pour Top (isolate 0.305): 0,46.99 55.88,46.99 55.88,0 0,0
LC_DOUT  (via drill 0.38)
  Top 0.203: U1.12 v29.53,13.97 | U4.32 25.08,29.94 25.08,22.86 25.4,22.54 25.4,14.1 v25.27,13.97
  Bottom 0.203: v29.53,13.97 v25.27,13.97
LC_SCK  (via drill 0.38)
  Top 0.203: U1.11 v29.53,12.7 | U4.1 26.35,31.32 26.35,27.62 | v24.45,19.68 24.45,19.37 24.77,19.05 24.77,15.24 24.45,14.92 24.45,13.02 v24.77,12.7 | 26.35,27.62 26.35,27.3 26.99,26.67 26.99,25.72 26.67,25.4 26.67,21.59 v26.99,21.27 | 26.35,31.64 26.35,27.62
  Bottom 0.203: v24.45,19.68 25.4,19.68 v26.99,21.27 | v24.77,12.7 v29.53,12.7
LV_SCL  (via drill 0.38)
  Top 0.203: R8.1 43.54,9.63 43.47,9.56 | 43.47,9.56 43.25,9.34 U3.1 | v43.5,9.53 43.47,9.56 | Q2.2 v34.92,9.53
  Bottom 0.203: v43.5,9.53 v34.92,9.53
LV_SDA
  Top 0.203: R9.1 38.63,9.63 38.92,9.34 39.62,9.34 | 46.94,9.48 Q1.2 46.67,9.26 46.67,8.89 46.55,8.76 39.75,8.76 39.62,8.89 39.62,9.34 | 40.96,9.31 U3.6 39.62,9.34
N$1
  Top 0.203: U4.7 27.91,36.29 28.32,35.88
N$2
  Top 0.203: 40.32,26.35 D3.A 40.32,26.27 40.32,24.77 40.96,24.13 R5.1
N$3
  Top 0.203: U4.8 26.52,37.95 26.99,38.42 28.19,38.42 28.32,38.28
N$4
  Top 0.203: R6.1 C5.1 45.81,31.5 46.48,31.5 46.57,31.59 JP7.D-
N$5
  Top 0.203: R13.1 41.27,19.68 43.18,21.59 43.5,21.59 43.5,21.91 D1.A
N$6  (via drill 0.38)
  Top 0.203: v41.59,16.19 41.59,14.92 R15.1 | D2.A 44.45,17.46 44.77,17.14 v44.77,16.19
  Bottom 0.203: v41.59,16.19 v44.77,16.19
N$7
  Top 0.203: R1.1 C2.1 46.61,32.64 46.86,32.38 JP7.D+
N$8  (via drill 0.38)
  Top 0.203: U6.12 40.01,32.07 v39.37,31.43 | R6.2 42.93,29.84 42.61,30.16 v42.61,31.43
  Bottom 0.203: v42.61,31.43 v39.37,31.43
N$9
  Top 0.203: U1.15 R7.1 31.54,16.73 31.75,16.51 32.16,16.51 SJ2.2
N$10
  Top 0.203: R3.2 21.59,11.11 21.91,11.43 U1.7 23.81,11.43 24.13,11.11 24.13,8.57 C8.1
N$11
  Top 0.203: R4.2 C8.2 22.6,8.62 U1.8
N$12
  Top 0.203: JP7.VBUS 48.3,29.49 48.58,29.21 49.72,29.21 50.04,28.89 50.04,25.91 49.53,25.4 | 49.53,25.4 49.02,25.4 F1.1 48.77,25.02 | C14.1 49.62,25.31 49.53,25.4
N$13
  Top 0.203: R1.2 42.74,33.97 41.4,35.31 40.89,35.31 40.64,35.05 U6.11
N$14  (via drill 0.38)
  Top 0.203: U6.4 v36.83,27.62 | v39.05,20.64 39.05,14.29 v38.73,13.97 | v28.89,26.67 28.89,24.7 v30.61,22.99 | R12.2 v46.67,13.97
  Bottom 0.203: v36.83,27.62 29.84,27.62 v28.89,26.67 | v39.05,20.64 32.96,20.64 v30.61,22.99 | v38.73,13.97 39.37,13.97 39.69,13.65 40.96,13.65 41.27,13.97 v46.67,13.97
N$15  (via drill 0.38)
  Top 0.203: U1.16 26.99,19.05 26.67,18.73 v26.67,7.11 | v45.09,7.3 45.09,5.7 JP6.3
  Bottom 0.203: v26.67,7.11 44.9,7.11 v45.09,7.3
N$16  (via drill 0.38)
  Top 0.203: U6.20 v34.92,32.7 | v51.12,27.94 50.48,27.3 50.48,21.27 48.58,19.37 R11.2 | v40.96,32.7 40.96,30.8 v40.64,30.48
  Bottom 0.203: v34.92,32.7 v40.96,32.7 | v40.64,30.48 41.91,29.21 46.99,29.21 48.26,27.94 v51.12,27.94
N$17
  Top 0.203: Q3.1 21.27,19.05 21.59,18.73 21.59,18.1 21.91,17.78 U1.2
N$18
  Top 0.203: U1.4 21.91,15.24 21.27,15.88 18.84,15.88 | R16.1 18.84,15.88 | 18.84,15.88 R17.2
N$19
  Top 0.203: J1.1 44.45,2.86 43.5,3.81 43.5,5.51 JP6.1
N$20  (via drill 0.38)
  Top 0.203: J3.2 33.02,3.49 v31.75,2.22 | J2.2 23.18,5.08 24.77,3.49 26.35,3.49 v27.94,1.91
  Bottom 0.203: v27.94,1.91 28.89,1.91 29.53,2.54 31.43,2.54 v31.75,2.22
N$21
  Top 0.203: C11.2 21.59,13.02 21.91,12.7 U1.6
N$22
  Top 0.203: J2.1 J4.1
N$24
  Top 0.203: J5.1 J3.1
N$27
  Top 0.203: U6.1 34.92,26.99 34.61,26.67 34.61,25.39 Q4.2 34.52,25.3 R10.1
RIPUP@
  Top 0.203: U1.3 21.91,16.51 21.27,17.14 R16.2 18.59,19.09 Q3.3
  Top 0.508: L1.2 17.78,20.81 Q3.3
RST  (via drill 0.38)
  Top 0.203: C1.2 v35.56,18.73 | v22.54,24.45 22.54,29.91 U4.29 22.62,30.08 22.54,30.16 v22.54,35.56 | 34.61,43.18 40.89,43.18 41.4,42.67 41.4,41.91 | 34.61,43.18 JP5.5 | v34.61,36.51 34.61,43.18 | S2.3 42.04,41.27 41.4,41.91 | 41.4,41.91 R2.1
  Bottom 0.203: v35.56,18.73 35.24,19.05 33.02,19.05 28.57,23.5 27.3,23.5 26.99,23.81 22.86,23.81 22.54,24.13 v22.54,24.45 | v34.61,36.51 34.29,36.2 23.18,36.2 v22.54,35.56
RXD  (via drill 0.38)
  Top 0.203: 48.58,15.24 v48.58,13.34 | U4.30 23.5,29.93 23.5,29.21 23.18,28.89 23.18,28.26 v23.81,27.62 | v37.91,27.62 37.91,27.43 37.47,26.99 37.47,17.46 36.2,16.19 v36.2,15.56 | v49.85,15.24 48.58,15.24 | 48.58,15.24 R11.1
  Top 0.254: JP9.TXO 54.04,15.24 v52.77,13.97
  Bottom 0.203: v37.91,27.62 37.91,28.13 37.47,28.57 28.89,28.57 27.94,27.62 v23.81,27.62 | v49.85,15.24 40.32,15.24 40.01,15.56 v36.2,15.56
  Bottom 0.254: v48.58,13.34 52.13,13.34 v52.77,13.97
RXLED  (via drill 0.38)
  Top 0.203: D1.C 40.32,21.91 40.32,22.23 40.01,22.23 40.01,22.54 39.05,23.5 v39.05,27.62 | U6.17 36.83,32.77 v35.75,31.69
  Bottom 0.203: v35.75,31.69 35.75,31.24 38.73,28.26 38.73,27.94 v39.05,27.62
SCL  (via drill 0.38)
  Top 0.203: Q2.3 v32.38,10.48 | U4.28 21.91,29.91 21.91,27.5 v20.89,26.48 | v26.04,26.35 26.04,12.06 v25.72,11.75
  Bottom 0.203: v32.38,10.48 26.99,10.48 v25.72,11.75 | v20.89,26.48 23.37,26.48 23.5,26.35 v26.04,26.35
SDA  (via drill 0.38)
  Top 0.203: U4.27 20.95,29.93 20.95,27.94 19.68,26.67 v19.68,25.72 | v51.44,26.35 51.12,26.04 51.12,12.38 50.8,12.06 50.8,10.79 50.48,10.48 Q1.3
  Bottom 0.203: v19.68,25.72 25.08,25.72 25.4,25.4 26.67,25.4 26.99,25.72 45.72,25.72 46.04,26.04 51.12,26.04 v51.44,26.35
TEMP_DAT  (via drill 0.38)
  Top 0.203: R14.1 28.68,31.43 28.26,31.43 27.4,32.29 U4.2 25.62,32.29 25.4,32.07 v23.81,32.07 | JP1.2 9.35,34.29 JP4.2 10.16,33.34 v11.43,32.07
  Bottom 0.203: v23.81,32.07 23.81,31.75 23.43,31.37 13.79,31.37 13.09,32.07 v11.43,32.07
TXD  (via drill 0.38)
  Top 0.203: v46.99,25.08 v46.99,18.41 46.67,18.1 R12.1 | v24.13,28.77 24.13,29.9 U4.31 | v27.62,28.89 27.62,25.21 v27.94,24.89
  Bottom 0.203: v24.13,28.77 27.5,28.77 v27.62,28.89 | v46.99,18.41 50.16,18.41 52.39,16.19 52.39,15.56 54.61,13.34 JP9.RXI | v46.99,25.08 34.92,25.08 34.61,24.77 28.07,24.77 v27.94,24.89
TXLED  (via drill 0.38)
  Top 0.203: v40.01,18.73 40.32,18.41 40.32,17.46 D2.C | U6.10 40.64,29.53 40.01,30.16 39.43,30.16 v39.37,30.1 | v45.09,18.73 45.09,20.32 44.77,20.64 44.77,21.59 45.09,21.91 v45.09,27.94
  Bottom 0.203: v45.09,18.73 v40.01,18.73 | v45.09,27.94 41.53,27.94 v39.37,30.1

### Text on the board
Bottom: v10
tPlace: ISP | Reset | RED / 5V | TEMP | WHT / SIG | BLK / GND | LOAD CELL | OpenScale | RED / E+ | ST | BLK / E- | Serial Out | GND | RX | WHT / A- | GND | TX | 5V | GRN / A+ | RATE | RX | YLW / SHD | TX | Fixed / Gain / 32 | B- | DTR | B+ | - | + | C | - | + | C | 3.3V | 5V | UL | UR | 3.3V | Load Sensor Combinator | LR | LL
bPlace: 5V | SIG | GND | Ext Temp | RED | Serial Out | BLK | OpenScale | BLK | GND | WHT | GND | GRN | 5V | YLW | RX | Load Cell | TX | GRN | B- | DTR | B+ | UL | UR | LL | - | + | C | - | + | C | LR
Measures: All units in Inches
tDocu: Revision By: Mary West